# Altium schematic sheet Optotransistor.SchDoc
size A4; SheetNumber: 4; SheetTotal: 4
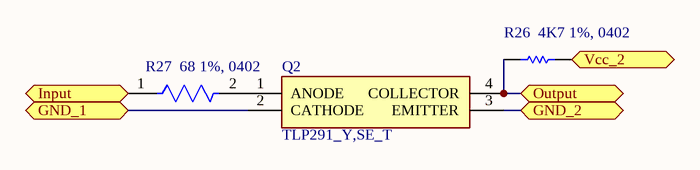
[diagram p0: Optotransistor.SchDoc]

## Parts
Q2  TLP291_Y,SE_T  [SOIC127P700X220-4N]
R26  4K7 1%, 0402  [RESC1005X40X25LL05T05]
R27  68 1%, 0402  [FP-ERJ2RK-MFG]

## Ports
GND_1 (bidir, see MainShunt[2C]), GND_2 (bidir, see MainShunt[3C]), Input (bidir, see MainShunt[2C]), Output (bidir, see MainShunt[3C]), Vcc_2 (bidir, see MainShunt[3C])

## Nets
GND_1: Q2.2(CATHODE) ; port GND_1
GND_2: Q2.3(EMITTER) ; port GND_2
Input: R27.1 ; port Input
Output: Q2.4(COLLECTOR) R26.2 ; port Output
Vcc_2: R26.1 ; port Vcc_2
NetQ2_1: Q2.1(ANODE) R27.2

## Library data of the parts
Q2 = TLP291_Y,SE_T: Phototransistor; Manufacturer_Name: Toshiba; Manufacturer_Part_Number: TLP291(Y,SE(T; Datasheet Link: https://toshiba.semicon-storage.com/info/docget.jsp?did=12884&prodName=TLP291; Height: 2.2mm
R26 = CMP-2002-01154-4: Chip Resistor, 4.7 KOhm, +/- 1%, 0.1 W, -55 to 155 degC, 0402 (1005 Metric), RoHS, Tape and Reel; PartNumber: ERJ-2RKF4701X; Voltage Rating: 50 V; Case\/Package: 0402; Power Rating: 100 mW; Height: 0.35 mm; Mounting Technology: Surface Mount; REACH SVHC: Yes; Resistance: 4.7 KOhm; Max Operating Temperature: 155 degC; ComponentLink1Description: Manufacturer URL; ComponentLink2Description: Datasheet; Pins: 2; PackageReference: 0402; Tolerance: 1%; Case Code (Imperial): 0402; Length: 1 mm; PackageDescription: 2-Pin Surface Mount Device, Body 1 x 0.5 mm; RoHSCompliant: true; Package Quantity: 1; Radiation Hardening: No; DatasheetVersion: 04/2015; Width: 0.5 mm; Case Code (Metric): 1005; Mount: Surface Mount; ComponentLink1URL: http://www.panasonic.com/; Min Operating Temperature: -55 degC; Packaging: Cut Tape; ComponentLink2URL: http://industrial.panasonic.com/cdbs/www-data/pdf/RDA0000/AOA0000C86.pdf
R27 = CMP-2002-01170-2: NexarPartId: 55529255; Voltage Rating: 50V; Temperature Coefficient: 100ppm/°C; Power Rating: 100mW; Resistance: 68Ω; Case Code (Imperial): 0402; Length: 1mm; REACH SVHC: No SVHC; Lead Free: Lead Free; Packaging: Cut Tape; RoHS: Compliant; Features: Automotive AEC-Q200; Voltage Rating (DC): 50V; Height: 350µm; Number of Pins: 2; Schedule B: 8533210045, 8533210045; Composition: Thick Film; Case/Package: 0402; Width: 508µm; Number of Terminations: 2; Min Operating Temperature: -55°C; Mount: Surface Mount; Depth: 500µm; Weight: 793.786648µg; Military Standard: Not; Termination: SMD/SMT; Tolerance: 1%; Max Power Dissipation: 100mW; Max Operating Temperature: 155°C; Lifecycle Status: Production; Contact Plating: Tin; Case Code (Metric): 1005